# EAGLE schematic XL4432-SMT1.1 (EAGLE 6.4)
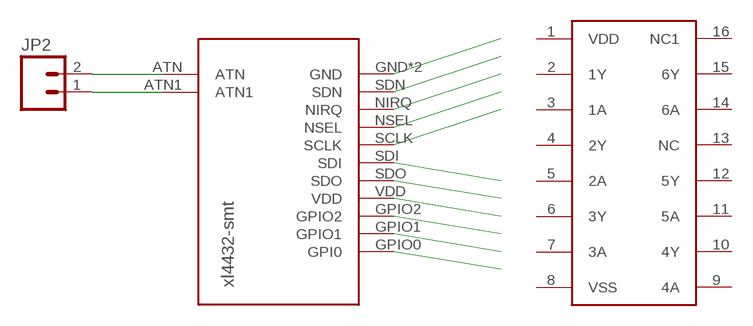
[diagram p0: schematic, sheet 1]

## Parts
JP2  M02LOCK  [1X02_LOCK]
U$1  XL4432-SMT  [XL4432-SMT]
U$2  4050BT  [SO16]

## Nets
GND: U$1.GND U$1.GND1(GND)
GPIO0: U$1.GPIO0(GPI0)
GPIO1: U$1.GPIO1
GPIO2: U$1.GPIO2
N$12: JP2.2 U$1.ATN
N$13: JP2.1 U$1.ATN1
NIRQ: U$1.NIRQ
NSEL: U$1.NSEL
SDI: U$1.SDI
SDN: U$1.SDN
SDO: U$1.SDO
SLCK: U$1.SCLK
VDD: U$1.VDD
Unconnected: U$2.1(VDD) U$2.2(1Y) U$2.3(1A) U$2.4(2Y) U$2.5(2A) U$2.6(3Y) U$2.7(3A) U$2.8(VSS) U$2.9(4A) U$2.10(4Y) U$2.11(5A) U$2.12(5Y) U$2.13(NC) U$2.14(6A) U$2.15(6Y) U$2.16(NC1)

## Library data of the parts
JP2 = SparkFun:M02: Header 2 Standard 2-pin 0.1" header. Use with straight break away headers (SKU : PRT-00116), right angle break away headers (PRT-00553), swiss pins (PRT-00743), machine pins (PRT-00117), and female headers (PRT-00115). Molex polarized connector foot print use with SKU : PRT-08233 with associated crimp pins and housings.
U$1 = Random parts:XL4432-SMT
U$2 = SparkFun:4050BT